# Altium schematic sheet Spartan6-IO23.SchDoc
size A
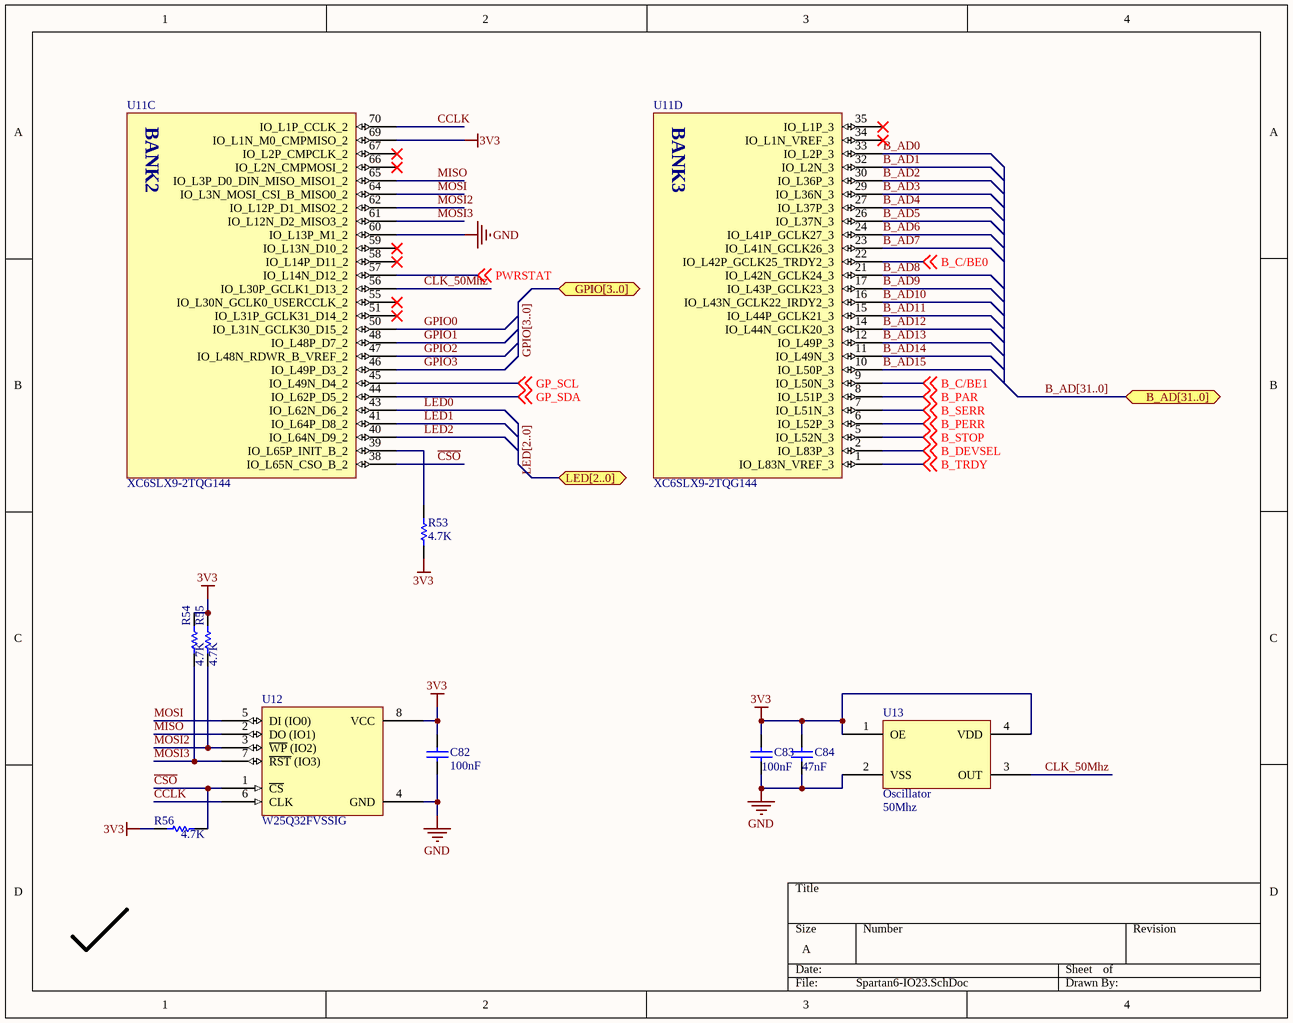
[diagram p0: Spartan6-IO23.SchDoc]

## Parts
C82  value 100nF  [0603PKG]  (hidden comment: Cap Semi)
C83  value 100nF  [0603PKG]  (hidden comment: Cap)
C84  value 47nF  [0603PKG]  (hidden comment: Cap)
R53  value 4.7K  [0603PKG]  (hidden comment: Res1)
R54  value 4.7K  [0603PKG]  (hidden comment: Res1)
R55  value 4.7K  [0603PKG]  (hidden comment: Res1)
R56  value 4.7K  [0603PKG]  (hidden comment: Res1)
U11  XC6SLX9-2TQG144  [TQG144]  (parts C,D of 7)
U12  W25Q32FVSSIG  [SSOP8]
U13  Oscillator  Freq: 50Mhz  [Crystal5x7]

## Ports
B_AD[31..0], GPIO[3..0], LED[2..0]

## Nets
3V3: C82.1 C83.2 C84.2 R53.2 R54.2 R55.2 R56.1 U11.69(IO_L1N_M0_CMPMISO_2) U12.8(VCC) U13.1(OE) U13.4(VDD)
GND: C82.2 C83.1 C84.1 U11.60(IO_L13P_M1_2) U12.4(GND) U13.2(VSS)
B_AD0: U11.33(IO_L2P_3)
B_AD1: U11.32(IO_L2N_3)
B_AD2: U11.30(IO_L36P_3)
B_AD3: U11.29(IO_L36N_3)
B_AD4: U11.27(IO_L37P_3)
B_AD5: U11.26(IO_L37N_3)
B_AD6: U11.24(IO_L41P_GCLK27_3)
B_AD7: U11.23(IO_L41N_GCLK26_3)
B_AD8: U11.21(IO_L42N_GCLK24_3)
B_AD9: U11.17(IO_L43P_GCLK23_3)
B_AD10: U11.16(IO_L43N_GCLK22_IRDY2_3)
B_AD11: U11.15(IO_L44P_GCLK21_3)
B_AD12: U11.14(IO_L44N_GCLK20_3)
B_AD13: U11.12(IO_L49P_3)
B_AD14: U11.11(IO_L49N_3)
B_AD15: U11.10(IO_L50P_3)
B_C/BE0: U11.22(IO_L42P_GCLK25_TRDY2_3) ; off-sheet B_C/BE0
B_C/BE1: U11.9(IO_L50N_3) ; off-sheet B_C/BE1
B_DEVSEL: U11.2(IO_L83P_3) ; off-sheet B_DEVSEL
B_PAR: U11.8(IO_L51P_3) ; off-sheet B_PAR
B_PERR: U11.6(IO_L52P_3) ; off-sheet B_PERR
B_SERR: U11.7(IO_L51N_3) ; off-sheet B_SERR
B_STOP: U11.5(IO_L52N_3) ; off-sheet B_STOP
B_TRDY: U11.1(IO_L83N_VREF_3) ; off-sheet B_TRDY
~{CSO}: R56.2 U11.38(IO_L65N_CSO_B_2) U12.1(~{CS})
CCLK: U11.70(IO_L1P_CCLK_2) U12.6(CLK)
CLK_50Mhz: U11.56(IO_L30P_GCLK1_D13_2) U13.3(OUT)
GP_SCL: U11.45(IO_L49N_D4_2) ; off-sheet GP_SCL
GP_SDA: U11.44(IO_L62P_D5_2) ; off-sheet GP_SDA
GPIO0: U11.50(IO_L31N_GCLK30_D15_2)
GPIO1: U11.48(IO_L48P_D7_2)
GPIO2: U11.47(IO_L48N_RDWR_B_VREF_2)
GPIO3: U11.46(IO_L49P_D3_2)
LED0: U11.43(IO_L62N_D6_2)
LED1: U11.41(IO_L64P_D8_2)
LED2: U11.40(IO_L64N_D9_2)
MISO: U11.65(IO_L3P_D0_DIN_MISO_MISO1_2) U12.2(DO_(IO1))
MOSI: U11.64(IO_L3N_MOSI_CSI_B_MISO0_2) U12.5(DI_(IO0))
MOSI2: R55.1 U11.62(IO_L12P_D1_MISO2_2) U12.3(~{WP}_(IO2))
MOSI3: R54.1 U11.61(IO_L12N_D2_MISO3_2) U12.7(~{RST}_(IO3))
PWRSTAT: U11.57(IO_L14N_D12_2) ; off-sheet PWRSTAT
NetR53_1: R53.1 U11.39(IO_L65P_INIT_B_2)

Not connected (* = marked no-connect by the designer): U11 34(IO_L1N_VREF_3)* 35(IO_L1P_3)* 51(IO_L31P_GCLK31_D14_2)* 55(IO_L30N_GCLK0_USERCCLK_2)* 58(IO_L14P_D11_2)* 59(IO_L13N_D10_2)* 66(IO_L2N_CMPMOSI_2)* 67(IO_L2P_CMPCLK_2)*

## Buses and harness runs
bus B_AD[31..0] = port B_AD[31..0]
bus GPIO[3..0] = port GPIO[3..0]
bus LED[2..0] = port LED[2..0]

## Notes on the sheet
- (in symbol XC6SLX9-2TQG144C, part C) BANK2
- (in symbol XC6SLX9-2TQG144C, part D) BANK3

## Library data of the parts
C82 = Cap Semi: Capacitor (Semiconductor SIM Model); Published: 8-Jun-2000; LatestRevisionDate: 29-May-2009; LatestRevisionNote: IPC-7351 Footprint Added.; PackageReference: C1206; Publisher: Altium Limited; PackageDescription: Chip Capacitor
C83 C84 = Cap: Capacitor; Published: 8-Jun-2000; LatestRevisionDate: 17-Jul-2002; LatestRevisionNote: Re-released for DXP Platform.; PackageReference: RAD-0.3; Publisher: Altium Limited; PackageDescription: Radial Cap, Thru-Hole; 2 Leads; 0.3 in Pin Spacing
R53-R56 = Res1: Resistor; Published: 8-Jun-2000; LatestRevisionDate: 17-Jul-2002; LatestRevisionNote: Re-released for DXP Platform.; PackageReference: AXIAL-0.3; Publisher: Altium Limited; PackageDescription: Axial Device, Thru-Hole; 2 Leads; 0.3 in Pin Spacing
U11 = XC6SLX9-2TQG144C: Xilinx Spartan6 LX9